# Altium schematic sheet MCUAntenna.SchDoc: Bluetooth MCU Antenna
size A4; Engineer: David; DocumentNumber: 4; SheetNumber: 4; SheetTotal: 9; Project: SmartCanton Dev Box; Labo: LSN; PageSetup: Record=PageOptions|CenterHorizontal=True|CenterVertical=True|PrintScale=0.97|XCorrection=1.00|YCorrection=1.00|PrintKind=1|BorderSize=5000000|LeftOffset=0|BottomOffset=0|Orientation=2|PaperLength=1000|PaperWidth=1000|Scale=100|PaperSource=7|PrintQuality=-3|MediaType=1|DitherType=10|PrintScaleMode=1|PaperKind=A4 (210 x 297 mm)|PaperIndex=9
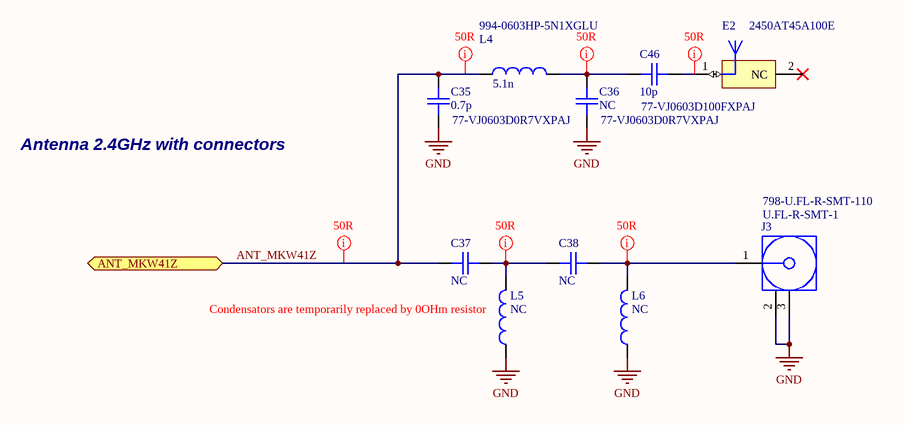
[diagram p0: MCUAntenna.SchDoc]

## Parts
C35  0.7p  Supplier Part Number 1: 77-VJ0603D0R7VXPAJ  [CAPC1608X08]
C36  NC  Supplier Part Number 1: 77-VJ0603D0R7VXPAJ  [CAPC1608X08]
C37  NC  [CAPC1608X08]
C38  NC  [CAPC1608X08]
C46  10p  Supplier Part Number 1: 77-VJ0603D100FXPAJ  [CAPC1608X08]
E2  2450AT45A100E  [Antenne 2.4ghz Ceramique]
J3  U.FL-R-SMT-1  Supplier Part Number 1: 798-U.FL-R-SMT-110  [U.FL-R-SMT-1]
L4  5.1n  Supplier Part Number 1: 994-0603HP-5N1XGLU  [INDC1608X08]
L5  NC  [INDC1608X08]
L6  NC  [INDC1608X08]

## Ports
ANT_MKW41Z

## Nets
GND: C35.1 C36.1 J3.2(GND) J3.3(GND) L5.1 L6.1
ANT_MKW41Z: C35.2 C37.1 L4.1 ; port ANT_MKW41Z
NetC36_2: C36.2 C46.1 L4.2
NetC37_2: C37.2 C38.1 L5.2
NetC38_2: C38.2 J3.1(Signal) L6.2
NetC46_2: C46.2 E2.1(FEED)

Not connected (* = marked no-connect by the designer): E2 2(NC)*

## Layout directives
rule Impedance Constraint [Min = 49.50    Max = 50.50    ]; net class 50R: ANT_MKW41Z, NetC36_2, NetC37_2, NetC38_2, NetC46_2

## Notes on the sheet
- Antenna 2.4GHz with connectors
- (near L5) Condensators are temporarily replaced by 0OHm resistor
- Title:
- Date:
- Project:
- Engineer:
- Revision:
- Sheet
- of
- Labo:
- File:

## Library data of the parts
C35-C38 C46 = CMP-001-0010-A.3: MLCC Capacitor 1608; RevisionId: A.2; AccessRights: 2147483647; Folder: LSN\Components\Passifs\Condensateurs\; ContentType: Component; LifeCycleStateGUID: 706004B5-C76E-482E-903B-BA0E4FAE086A; ReleaseDate: 31/10/2016 02:21:03 PM; ContentTypeGUID: CB3C11C4-E317-11DF-B822-12313F0024A2; ItemGUID: 6B05C9AF-D3C2-4723-98C2-0E51694C471A; ItemHRID: CMP-001-0010; FolderGUID: 9DA6C5B0-B134-4C0D-99DA-A840DED25FBD; LifeCycle: New From Design; ComponentType: Capacitor
  C35: Value: 0.7p; Supplier 1: Mouser
  C36: Value: NC; Supplier 1: Mouser
  C37 C38: Value: NC
  C46: Value: 10p; Supplier 1: Mouser
E2 = CMP-001-0103-A.2: Antennas 2.45GHz ANTENNA HIGH GAIN (VERT); Supplier 1: Mouser; Supplier Part Number 1: 609-2450AT45A100E
J3 = CMP-001-0013-A.3: Hirose U.FL SMT connector; Datasheet: https://www.hirose.com/product/en/download_file/key_name/U.FL/category/Catalog/doc_file_id/31697/?file_category_id=4&item_id=15&is_series=1; Drawing: https://www.hirose.com/product/en/download_file/key_name/U.FL-R-SMT-1%2810%29/category/Drawing%20(2D)/doc_file_id/37627/?file_category_id=6&item_id=03310472210&is_series=; Supplier 1: Mouser
L4-L6 = CMP-001-0101-A.4: Ferrite Beads 1608; RevisionId: A.3; AccessRights: 2147483647; Folder: LSN\Components\Passifs\Inductances\; ContentType: Component; LifeCycleStateGUID: 706004B5-C76E-482E-903B-BA0E4FAE086A; ReleaseDate: 31/07/2017 06:40:06 PM; ContentTypeGUID: CB3C11C4-E317-11DF-B822-12313F0024A2; ItemGUID: 17F6FBB7-027A-4BA7-9144-FCD7399F32FE; ItemHRID: CMP-001-0101; FolderGUID: CF708A04-0EC7-4EEE-8F3D-D187CFC5366D; LifeCycle: New From Design
  L4: value: 5.1n; Supplier 1: Mouser
  L5 L6: value: NC